# EAGLE schematic ridicideska (EAGLE 6.3)

## Sheet 1 of 3: Pro sensory vlhkosti
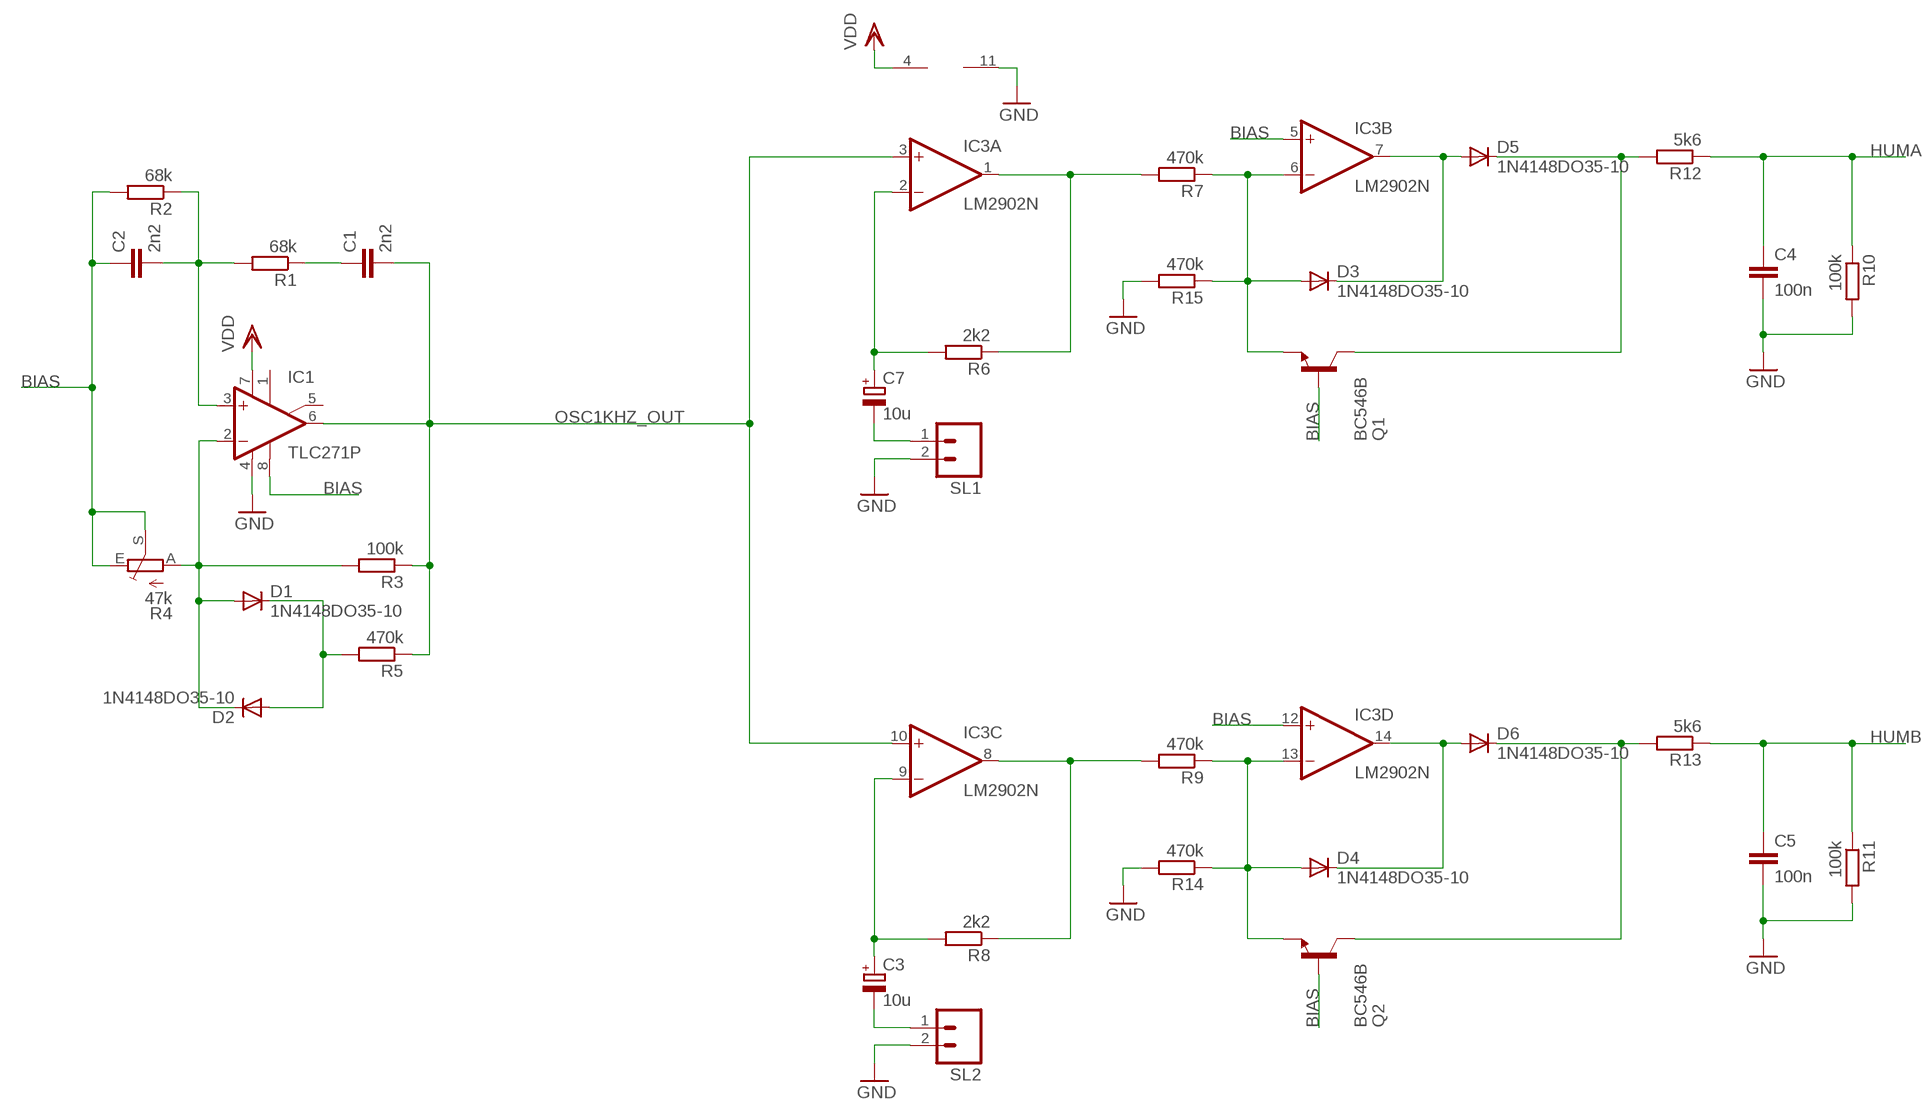
[diagram p0: schematic, sheet 1]

### Parts
C1  2n2  C-EUC0805  [C0805]
C2  2n2  C-EUC0805  [C0805]
C3  10u  CPOL-EUE5-13  [E5-13]
C4  100n  C-EUC0805  [C0805]
C5  100n  C-EUC0805  [C0805]
C7  10u  CPOL-EUE5-13  [E5-13]
D1  1N4148DO35-10  [DO35-10]
D2  1N4148DO35-10  [DO35-10]
D3  1N4148DO35-10  [DO35-10]
D4  1N4148DO35-10  [DO35-10]
D5  1N4148DO35-10  [DO35-10]
D6  1N4148DO35-10  [DO35-10]
IC1  TLC271P  [DIL08]
IC3  LM2902N  [DIL14]
Q1  BC546B  [TO92-EBC]
Q2  BC546B  [TO92-EBC]
R1  68k  R-EU_R0805  [R0805]
R2  68k  R-EU_R0805  [R0805]
R3  100k  R-EU_R0805  [R0805]
R4  47k  TRIM_EU-CA6V  [CA6V]
R5  470k  R-EU_R0805  [R0805]
R6  2k2  R-EU_R0805  [R0805]
R7  470k  R-EU_R0805  [R0805]
R8  2k2  R-EU_R0805  [R0805]
R9  470k  R-EU_R0805  [R0805]
R10  100k  R-EU_R0805  [R0805]
R11  100k  R-EU_R0805  [R0805]
R12  5k6  R-EU_R0805  [R0805]
R13  5k6  R-EU_R0805  [R0805]
R14  470k  R-EU_R0805  [R0805]
R15  470k  R-EU_R0805  [R0805]
SL1  M02  [02P]
SL2  M02  [02P]

### Nets
BIAS: C2.1 IC1.8(OPT) IC3.5(B:+IN) IC3.12(D:+IN) Q1.B Q2.B R2.2 R4.E R4.S ; also sheet 3
GND: C4.2 C5.2 IC1.4(V-) IC3.11(P:V-) R10.2 R11.2 R14.2 R15.2 SL1.2 SL2.2 ; also sheet 2,3
HUMA: C4.1 R10.1 R12.1 ; also sheet 2
HUMB: C5.1 R11.1 R13.1 ; also sheet 2
N$1: IC3.1(A:OUT) R6.1 R7.2
N$2: C1.1 R1.1
N$3: C2.2 IC1.3(+IN) R1.2 R2.1
N$4: C7.+ IC3.2(A:-IN) R6.2
N$5: D1.A D2.C IC1.2(-IN) R3.2 R4.A
N$6: C7.- SL1.1
N$7: D1.C D2.A R5.2
N$8: D3.A IC3.6(B:-IN) Q1.E R7.1 R15.1
N$9: D5.C Q1.C R12.2
N$10: D3.C D5.A IC3.7(B:OUT)
N$11: IC3.8(C:OUT) R8.1 R9.2
N$12: C3.+ IC3.9(C:-IN) R8.2
N$13: C3.- SL2.1
N$15: D4.A IC3.13(D:-IN) Q2.E R9.1 R14.1
N$16: D4.C D6.A IC3.14(D:OUT)
N$17: D6.C Q2.C R13.2
OSC1KHZ_OUT: C1.2 IC1.6(OUT) IC3.3(A:+IN) IC3.10(C:+IN) R3.1 R5.1
VDD: IC1.7(V+) IC3.4(P:V+) ; also sheet 2,3
Unconnected: IC1.1(ON1) IC1.5(ON2)

## Sheet 2 of 3
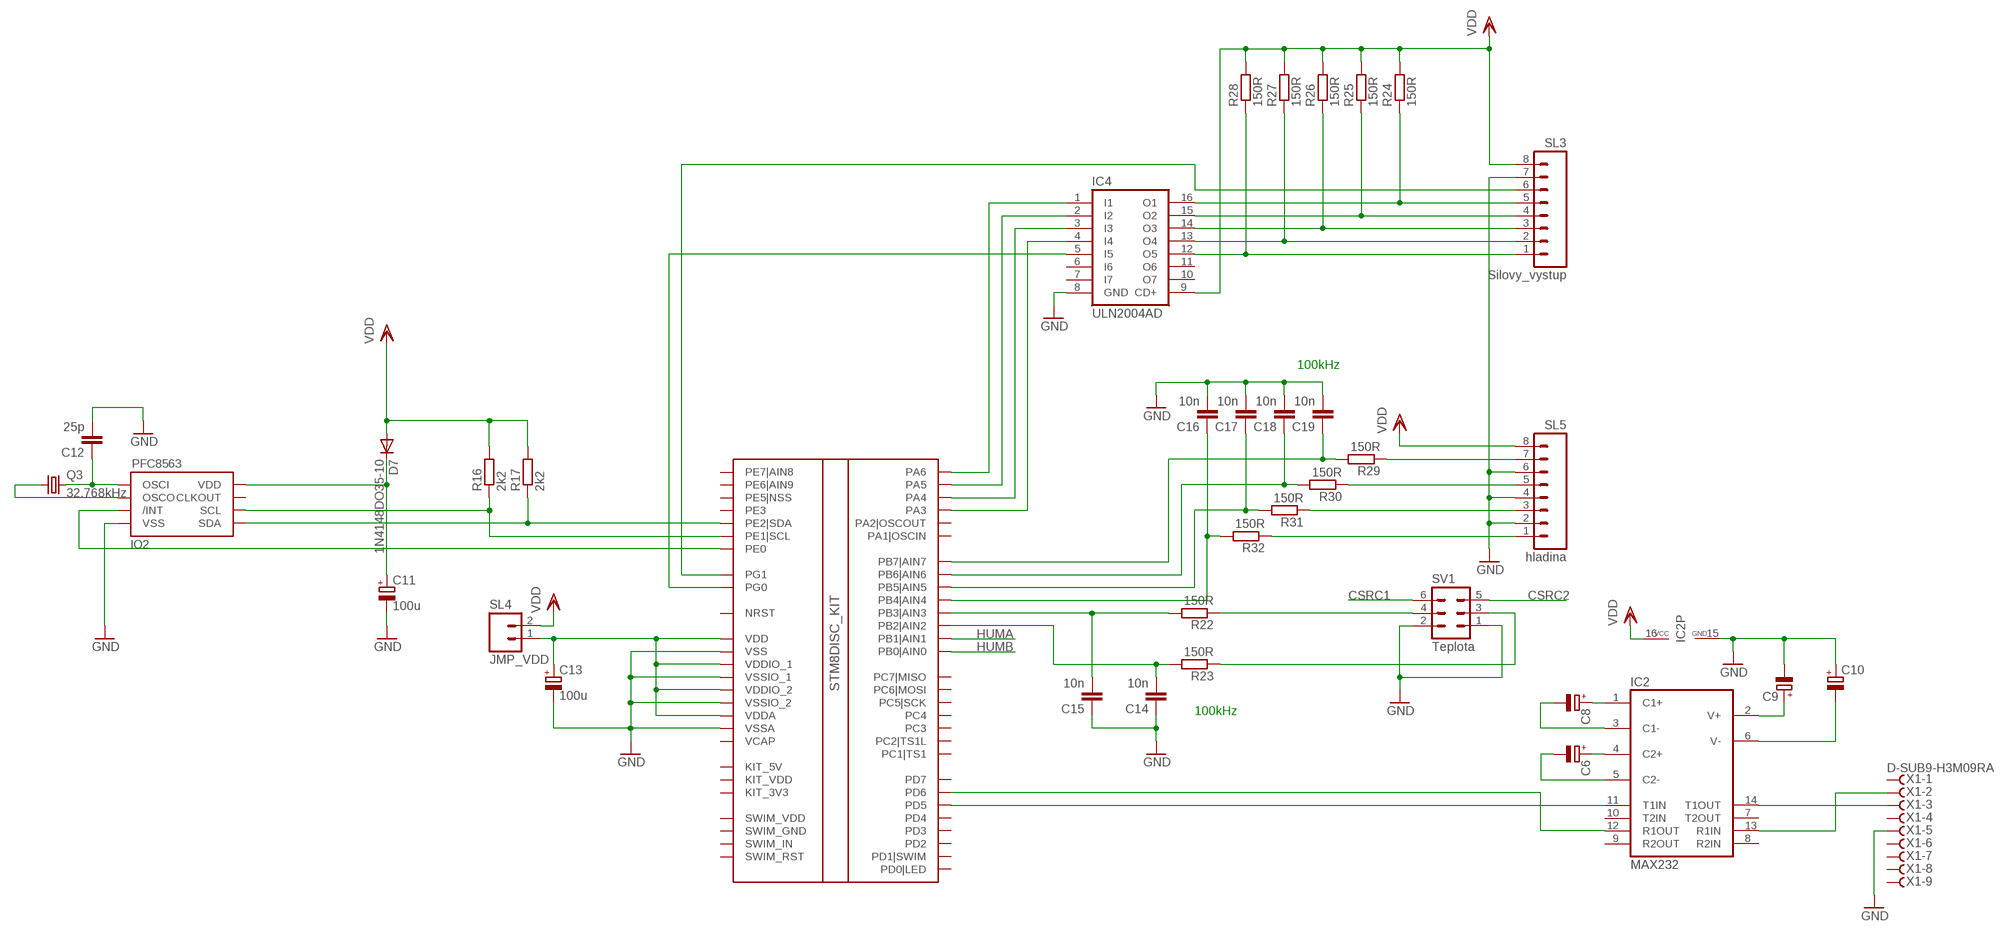
[diagram p1: schematic, sheet 2]

### Parts
C6  CPOL-EUE5-10.5  [E5-10,5]
C8  CPOL-EUE5-10.5  [E5-10,5]
C9  CPOL-EUE5-10.5  [E5-10,5]
C10  CPOL-EUE5-10.5  [E5-10,5]
C11  100u  CPOL-EUE5-10.5  [E5-10,5]
C12  25p  C-EUC0805  [C0805]
C13  100u  CPOL-EUE5-10.5  [E5-10,5]
C14  10n  C-EUC0805  [C0805]
C15  10n  C-EUC0805  [C0805]
C16  10n  C-EUC0805  [C0805]
C17  10n  C-EUC0805  [C0805]
C18  10n  C-EUC0805  [C0805]
C19  10n  C-EUC0805  [C0805]
D7  1N4148DO35-10  [DO35-10]
IC2  MAX232  [DIL16]
IC4  ULN2004AD  [SO16]
IO1  STM8_KIT  [STM8SDISCOVERY]
IO2  PFC8563  [SO08]
Q3  32.768kHz  CRYSTALHC49U70  [HC49U70]
R16  2k2  R-EU_0207/12  [0207/12]
R17  2k2  R-EU_0207/12  [0207/12]
R22  150R  R-EU_R0805  [R0805]
R23  150R  R-EU_R0805  [R0805]
R24  150R  R-EU_0207/12  [0207/12]
R25  150R  R-EU_0207/12  [0207/12]
R26  150R  R-EU_0207/12  [0207/12]
R27  150R  R-EU_0207/12  [0207/12]
R28  150R  R-EU_0207/12  [0207/12]
R29  150R  R-EU_R0805  [R0805]
R30  150R  R-EU_R0805  [R0805]
R31  150R  R-EU_R0805  [R0805]
R32  150R  R-EU_R0805  [R0805]
SL3  Silovy_vystup  M08  [08P]
SL4  JMP_VDD  M02  [02P]
SL5  hladina  M08  [08P]
SV1  Teplota  MA03-2  [MA03-2]
X1  D-SUB9-H3M09RA  [H3M09RA]

### Nets
CSRC1: SV1.6 ; also sheet 3
CSRC2: SV1.5 ; also sheet 3
GND: C9.- C10.+ C11.- C12.2 C13.- C14.1 C15.1 C16.2 C17.2 C18.2 C19.2 IC2.15(GND) IC4.8(GND) IO1.VSS IO1.VSSA IO1.VSSIO_1 IO1.VSSIO_2 IO2.4(VSS) SL3.7 SL5.2 SL5.4 SL5.6 SV1.1 SV1.2 X1.5 ; also sheet 1,3
HUMA: IO1.PB1(PB1|AIN1) ; also sheet 1
HUMB: IO1.PB0(PB0|AIN0) ; also sheet 1
N$14: IC2.11(T1IN) IO1.PD5
N$18: IC2.12(R1OUT) IO1.PD6
N$19: IC2.14(T1OUT) X1.3
N$20: IC2.13(R1IN) X1.2
N$21: C9.+ IC2.2(V+)
N$22: C10.- IC2.6(V-)
N$23: IO1.PE2(PE2|SDA) IO2.5(SDA) R17.1
N$24: C8.- IC2.3(C1-)
N$25: C8.+ IC2.1(C1+)
N$26: C6.+ IC2.4(C2+)
N$27: C6.- IC2.5(C2-)
N$28: IO1.PE1(PE1|SCL) IO2.6(SCL) R16.1
N$29: C11.+ D7.C IO2.8(VDD)
N$30: IO1.PE0 IO2.3(/INT)
N$31: IC4.1(I1) IO1.PA6
N$32: IC4.2(I2) IO1.PA5
N$33: IC4.3(I3) IO1.PA4
N$34: IC4.4(I4) IO1.PA3
N$35: IC4.5(I5) IO1.PG0
N$36: IO1.PG1 SL3.6
N$37: C15.2 IO1.PB3(PB3|AIN3) R22.2
N$38: R23.1 SV1.3
N$39: C12.1 IO2.1(OSCI) Q3.2
N$40: IO2.2(OSCO) Q3.1
N$42: C13.+ IO1.VDD IO1.VDDA IO1.VDDIO_1 IO1.VDDIO_2 SL4.1
N$45: R22.1 SV1.4
N$47: C14.2 IO1.PB2(PB2|AIN2) R23.2
N$48: IC4.16(O1) R24.1 SL3.5
N$49: IC4.15(O2) R25.1 SL3.4
N$50: IC4.14(O3) R26.1 SL3.3
N$51: IC4.13(O4) R27.1 SL3.2
N$52: IC4.12(O5) R28.1 SL3.1
N$53: C16.1 IO1.PB4(PB4|AIN4) R32.2
N$54: C17.1 IO1.PB5(PB5|AIN5) R31.2
N$55: C18.1 IO1.PB6(PB6|AIN6) R30.2
N$56: C19.1 IO1.PB7(PB7|AIN7) R29.2
N$57: R29.1 SL5.7
N$58: R30.1 SL5.5
N$59: R31.1 SL5.3
N$60: R32.1 SL5.1
VDD: D7.A IC2.16(VCC) IC4.9(CD+) R16.2 R17.2 R24.2 R25.2 R26.2 R27.2 R28.2 SL3.8 SL4.2 SL5.8 ; also sheet 1,3
Unconnected: IC2.7(T2OUT) IC2.8(R2IN) IC2.9(R2OUT) IC2.10(T2IN) IC4.6(I6) IC4.7(I7) IC4.10(O7) IC4.11(O6) IO1.KIT_3V3 IO1.KIT_5V IO1.KIT_VDD IO1.NRST IO1.PA1(PA1|OSCIN) IO1.PA2(PA2|OSCOUT) IO1.PC1(PC1|TS1) IO1.PC2(PC2|TS1L) IO1.PC3 IO1.PC4 IO1.PC5(PC5|SCK) IO1.PC6(PC6|MOSI) IO1.PC7(PC7|MISO) IO1.PD0(PD0|LED) IO1.PD1(PD1|SWIM) IO1.PD2 IO1.PD3 IO1.PD4 IO1.PD7 IO1.PE3 IO1.PE5(PE5|NSS) IO1.PE6(PE6|AIN9) IO1.PE7(PE7|AIN8) IO1.SWIM_GND IO1.SWIM_IN IO1.SWIM_RST IO1.SWIM_VDD IO1.VCAP IO2.7(CLKOUT) X1.1 X1.4 X1.6 X1.7 X1.8 X1.9

### Notes on the sheet
- 100kHz
- 100kHz

## Sheet 3 of 3
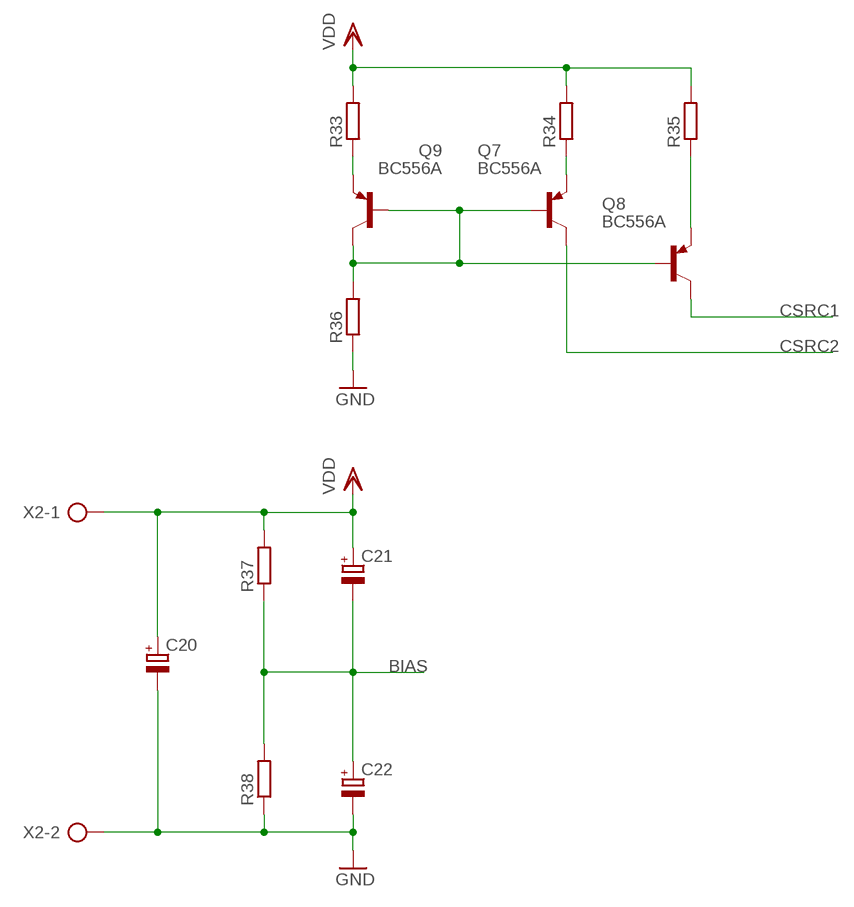
[diagram p2: schematic, sheet 3]

### Parts
C20  CPOL-EUE5-10.5  [E5-10,5]
C21  CPOL-EUE5-10.5  [E5-10,5]
C22  CPOL-EUE5-10.5  [E5-10,5]
Q7  BC556A  [TO92-EBC]
Q8  BC556A  [TO92-EBC]
Q9  BC556A  [TO92-EBC]
R33  R-EU_R0805  [R0805]
R34  R-EU_R0805  [R0805]
R35  R-EU_R0805  [R0805]
R36  R-EU_R0805  [R0805]
R37  R-EU_0207/12  [0207/12]
R38  R-EU_0207/12  [0207/12]
X2  AK300/2  [AK300/2]

### Nets
BIAS: C21.- C22.+ R37.1 R38.2 ; also sheet 1
CSRC1: Q8.C ; also sheet 2
CSRC2: Q7.C ; also sheet 2
GND: C20.- C22.- R36.1 R38.1 X2.2 ; also sheet 1,2
N$61: Q7.B Q8.B Q9.B Q9.C R36.2
N$62: Q7.E R34.1
N$63: Q8.E R35.1
N$64: Q9.E R33.1
VDD: C20.+ C21.+ R33.2 R34.2 R35.2 R37.2 X2.1 ; also sheet 1,2

## Library data of the parts
C1 C2 C4 C5 C12 C14-C19 = rcl:C-EU: CAPACITOR, European symbol
C3 C7 = rcl:CPOL-EU: POLARIZED CAPACITOR, European symbol
C6 C8-C11 C13 C20-C22 = resistor:CPOL-EU: POLARIZED CAPACITOR, European symbol
D1-D7 = diode:1N4148: DIODE high speed (Philips)
IC1 = linear:TLC271: OP AMP
IC2 = maxim:MAX232: RS232 TRANSEIVER; MF: MAXIM; MPN: MAX232ACPE+; OC_FARNELL: 9723773; OC_NEWARK: 68K4544
IC3 = linear:LM2902: Low power quad operational amplifier Source: Data sgeet <http://www.st.com/internet/com/TECHNICAL_RESOURCES/TECHNICAL_LITERATURE/DATASHEET/CD00000533.pdf>
IC4 = uln-udn:ULN2004A: DRIVER ARRAY
IO1 = atypPouzdra:STM8_KIT
IO2 = atypPouzdra:PFC8563
Q1 Q2 = transistor-npn:BC546*: NPN Transistor
Q3 = crystal:CRYSTAL: CRYSTAL; OC_FARNELL: unknown; OC_NEWARK: unknown
Q7-Q9 = transistor-pnp:BC556*: PNP Transistror
R1-R3 R5-R17 R22-R36 = rcl:R-EU_: RESISTOR, European symbol
R4 = pot:TRIM_EU-: POTENTIOMETER
R37 R38 = resistor:R-EU_: RESISTOR, European symbol
SL1 SL2 SL4 = con-amp-quick:M02: AMP QUICK CONNECTOR; OC_FARNELL: unknown; OC_NEWARK: unknown
SL3 SL5 = con-amp-quick:M08: AMP QUICK CONNECTOR; OC_FARNELL: unknown; OC_NEWARK: unknown
SV1 = con-lstb:MA03-2: PIN HEADER; OC_FARNELL: unknown; OC_NEWARK: unknown
X1 = con-thomas-betts:D-SUB9-: D-Subminiatur Connector Source: Electronioc Interconnects European Edition 1998; OC_FARNELL: unknown; OC_NEWARK: unknown
X2 = con-ptr500:AK300/2: CONNECTOR; OC_FARNELL: unknown; OC_NEWARK: unknown